# EAGLE design AutoProgramFTDI (EAGLE 9.2.0)
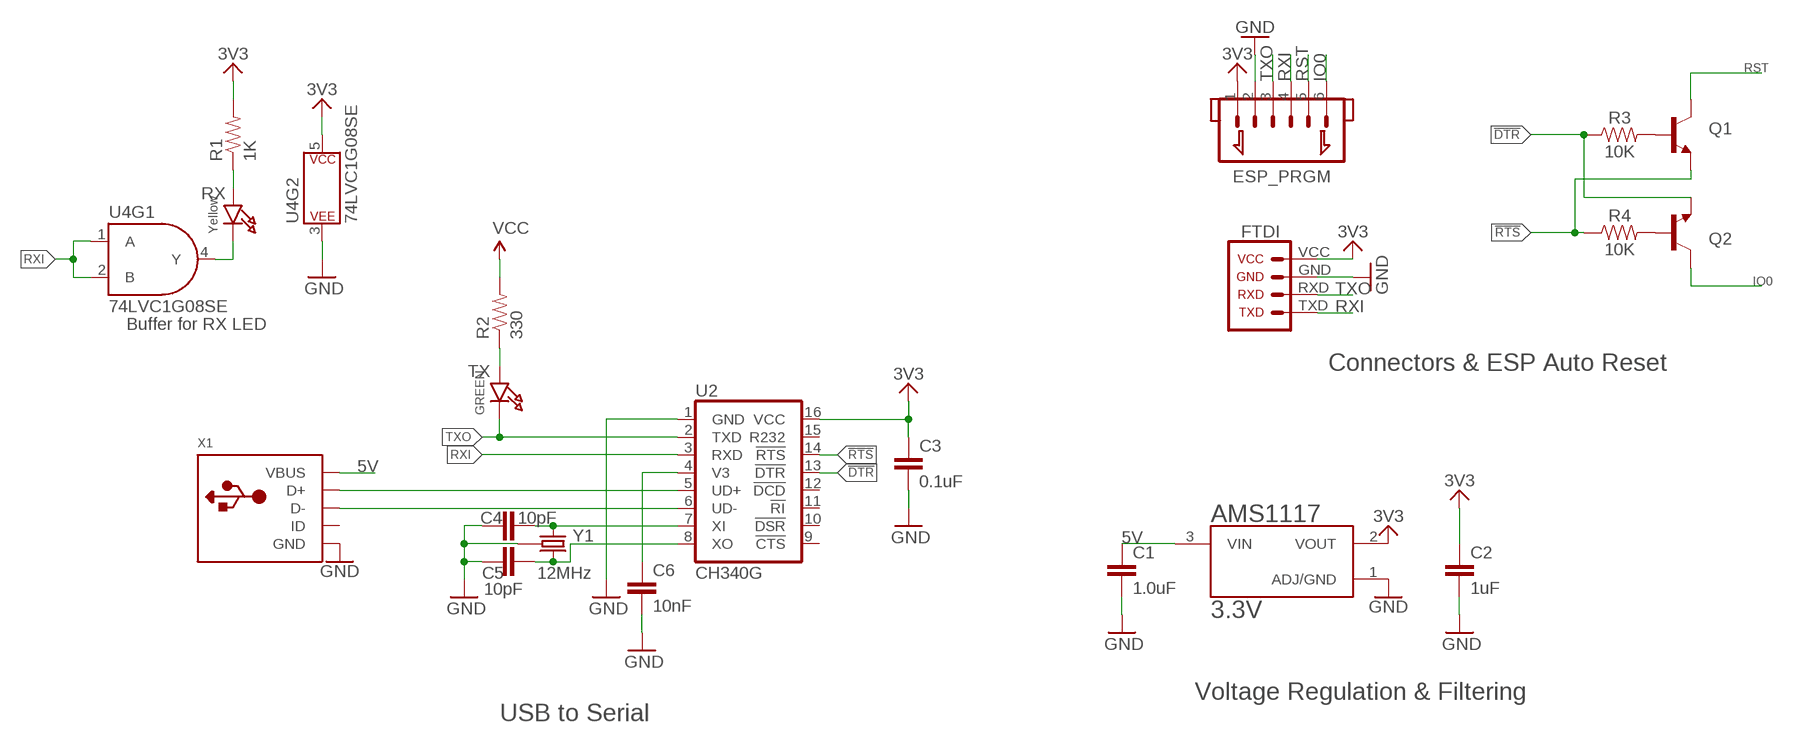
[diagram p0: schematic, sheet 1]

## Parts
AMS1117  3.3V  VREG_AMS1117  [SOT229P700X180-4N]
C1  1.0uF  1.0UF-16V-10%(0603)  [0603-CAP]
C2  1uF  1.0UF-16V-10%(0603)  [0603-CAP]
C3  0.1uF  0.1UF-25V(+80/-20%)(0603)  [0603-CAP]
C4  10pF  10PF-50V-5%(0603)  [0603-CAP]
C5  10pF  10PF-50V-5%(0603)  [0603-CAP]
C6  10nF  10NF/10000PF-50V-10%(0603)  [0603-CAP]
ESP_PRGM  JST_1.25_6P  [JST1.25_6P]
Q1  TRANSISTOR_NPNSOT23-3  [SPARKFUN_SOT23-3]
Q2  TRANSISTOR_NPNSOT23-3  [SPARKFUN_SOT23-3]
R1  1K  RESISTOR0603  [0603]
R2  330  RESISTOR0603  [0603]
R3  10K  RESISTOR0603  [0603]
R4  10K  RESISTOR0603  [0603]
RX  Yellow  LED0603  [MICROBUILDER_CHIPLED_0603]
TX  GREEN  LED0603  [MICROBUILDER_CHIPLED_0603]
U2  CH340G  FTDI_CH340GSMD  [SO016]
U4  74LVC1G08SE  GATE_7408  [SOT353]
U$6  FTDI  [1X06]
X1  USB_MICRO_20329_V2  [MICROUSB_4UCONN_20329_V2]
Y1  12MHz  CRYSTAL-GROUNDED3.2X2.5  [CRYSTAL-SMD-3.2X2.5]

## Nets
3.3V [power]: AMS1117.2(VOUT) C2.1 C3.1 ESP_PRGM.1 R1.2 U2.16(VCC) U4.5(P$V+) U$6.VCC ; supply symbol labelled SUPPLY_3.3V
5V: AMS1117.3(VIN) C1.1 X1.VBUS
!DTR: Q2.2(E) R3.1 U2.13(!DTR)
!RTS: Q1.2(E) R4.1 U2.14(!RTS)
GND [power]: AMS1117.1(ADJ/GND) C1.2 C2.2 C3.2 C4.1 C5.1 C6.2 ESP_PRGM.2 U2.1(GND) U4.3(P$V-) U$6.GND X1.BASE@1(GND) X1.BASE@2(GND) X1.GND X1.SPRT@1(GND) X1.SPRT@2(GND) X1.SPRT@3(GND) X1.SPRT@4(GND) Y1.2(GND) Y1.4(GND) ; supply symbol labelled SUPPLY_GND
IO0: ESP_PRGM.6 Q2.3(C)
N$1: R2.1 TX.A
N$2: R1.1 RX.A
N$3: C5.2 U2.8(XO) Y1.3
N$4: C4.2 U2.7(XI) Y1.1
N$5: RX.C U4.4(Y)
N$6: U2.6(UD-) X1.D-
N$7: U2.5(UD+) X1.D+
N$8: Q1.1(B) R3.2
N$9: Q2.1(B) R4.2
RST: ESP_PRGM.5 Q1.3(C)
RXI: ESP_PRGM.4 U2.3(RXD) U4.1(A) U4.2(B) U$6.TXD
TXO: ESP_PRGM.3 TX.C U2.2(TXD) U$6.RXD
V3: C6.1 U2.4(V3)
VCC: R2.2
Unconnected: U2.9(!CTS) U2.10(!DSR) U2.11(!RI) U2.12(!DCD) U2.15(R232) X1.ID

## Notes on the sheet
- Buffer for RX LED
- Connectors & ESP Auto Reset
- Voltage Regulation & Filtering
- USB to Serial

## Library data of the parts
AMS1117 = Scott-ICs:VREG_AMS1117: Sot223/Pkg 1-Amp 3.3-Volt Low Drop Out Voltage Regulatator; AVAILABILITY: Unavailable; DESCRIPTION: Sot223/Pkg 1-Amp 3.3-Volt Low Drop Out Voltage Regulatator; MF: Advanced Monolithic Systems; MP: AMS1117-3.3; PACKAGE: None; PRICE: None
C1 = SparkFun-Capacitors:1.0UF-16V-10%(0603): CAP-00868; PROD_ID: CAP-00868
C2 = SparkFun-Capacitors:1.0UF-16V-10%(0603): CAP-00868; PROD_ID: CAP-00868; VALUE: 1.0uF
C3 = SparkFun-Capacitors:0.1UF-25V(+80/-20%)(0603): CAP-00810 Ceramic Standard decoupling cap; PROD_ID: CAP-00810
C4 C5 = SparkFun-Capacitors:10PF-50V-5%(0603): CAP-11812; PROD_ID: CAP-11812
C6 = SparkFun-Capacitors:10NF/10000PF-50V-10%(0603): CAP-00867; PROD_ID: CAP-00867
ESP_PRGM = Scott-Connectors:JST_1.25_6P
Q1 Q2 = Scott-Electrical:TRANSISTOR_NPN: Transistor NPN BJT configuration in SOT23 package. MMBT2222 is the common NPN we use. Double check BCE configuration again layout.
R1-R4 = Scott-Electrical:RESISTOR: Generic Resistor Package
RX TX = Scott-Electrical:LED: LED 0603 - 0603 Surface Mount Package 2mA: Green LED - Low Power (3.9mcd, 2ma, 1.7Vf) - Digikey: 475-2709-2-ND Orange LED - Low Power (9.8mcd, 2ma, 1.8Vf) - Digikey: 475-1194-2-ND Red LED - Low Power (5mcd, 2ma, 1.8Vf) - Digikey: 475-1195-2-ND Yellow LED - Low Power (7mcd, 2ma, 1.8Vf) - Digikey: 475-1196-2-ND 5mA: Blue LED - Low Power (17mcd, 5ma, 2.9Vf) - Digikey: LNJ937W8CRACT-ND 0805 - 0805 Surface Mount Package 2mA: Red LED (8.8mcd, 2mA, 1.8Vf, Clear) - Low Power [Digikey: 475-2510-1-ND] Green LED (5mcd, 2mA, 1.8Vf, Clear) - Low Power [Digikey: 475-2730-1-ND] Yellow LED (11.3mcd, 2mA, 1.8Vf, Clear) - Low Power [Digikey: 475-2555-1-ND] 20mA: Red LED (104mcd, 20mA, Diffused) - LS R976 [Digikey: 475-1278-6-ND] Red LED (12mcd, 20mA, 2.0Vf, Clear) - APT2012EC [Digikey: 754-1128-1-ND] Green LED (15mcd, 20mA, 2.2Vf, Clear) - APT2012GC [Digikey: 754-1131-1-ND] Orange LED (160mcd, 20mA, 2.1Vf, Clear) - APT2012SECK [Digikey: 754-1130-1-ND] 1206 - 1206 Surface Mount Package Green LED (26mcd, 20mA, Diffused) - LG N971 [Digikey: 475-1407-6-ND] Red LED (15mcd, 20mA, Diffused) - LH N974 [Digikey: 475-1416-6-ND] Cree - Cree High-Power Surface Mount LEDs XPEBWT-L1-0000-00D50 - White 111lm 350mA 2.9Vf 6200K 110° XTEAWT-00-0000-00000LEE3 - White 114lm 350mA 2.85Vf 5000K 115° Everlight - Everlight 45-21 Series Surface Mount LEDs 45-21/QK2C-B2832AC2CB2/2T - Warm White 2000mcd 20mA 3.25Vf 3050K 120° 45-21/LK2C-B38452C4CB2/2T - Nuetral White 2000mcd 20mA 3.25Vf 4150K 120° 45-21/LK2C-B50634C6CB2/2T - Cold White 2200mcd 20mA 3.25Vf 5650K 120° PLCC2 Reverse Mount LS T77K-J1L2-1-0-2-R18-Z - Red 11.25mcd 2mA 1.8Vf 630nm 120° LO T77K-L1M2-24-Z - Orange 19.6mcd 2mA 1.8Vf 606nm 120° LY T77K-K2M1-26-Z - Yellow 15.7mcd 2mA 1.8Vf 587nm 120°
U2 = Scott-ICs:FTDI_CH340G: A simple USB 2.0 to Serial IC.; PROD_ID: IC-13498
U4 = Scott-ICs:GATE_74*08: Single AND gate IC GATE AND SNGL 2INPUT SOT353 SparkFun Products SparkFun LogicBlocks Kit <https://www.sparkfun.com/products/11006> (KIT-11006) SparkFun RedBot Mainboard <https://www.sparkfun.com/products/12097> (ROB-12097); PROD_ID: IC-10841
U$6 = Scott-Connectors:FTDI
X1 = Scott-Connectors:USB: USB Connectors USBMINIB - Surface Mount Female Mini-B USB Connector 4UConnector: 06564
Y1 = Scott-ICs:CRYSTAL-GROUNDED: Small, 3.2x2.5mm, SMD Crystal; PROD_ID: XTAL-13518

## Net classes
1 power: width 0.178 mm

## Board
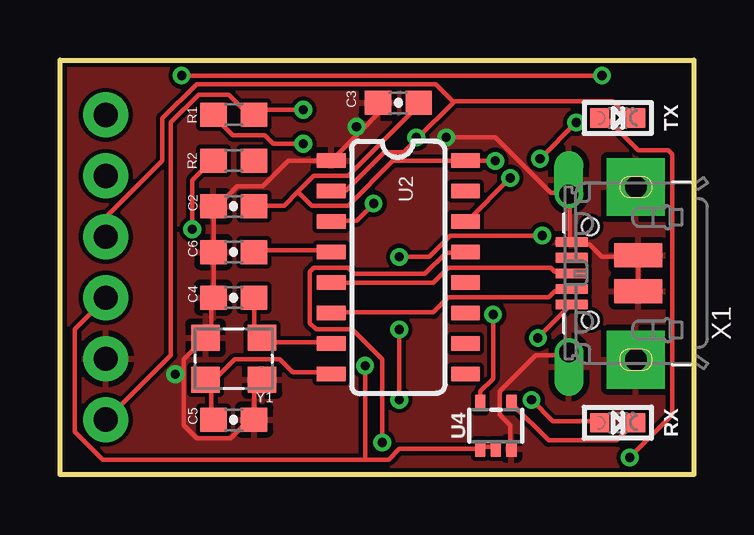
[diagram p1: board, top side]
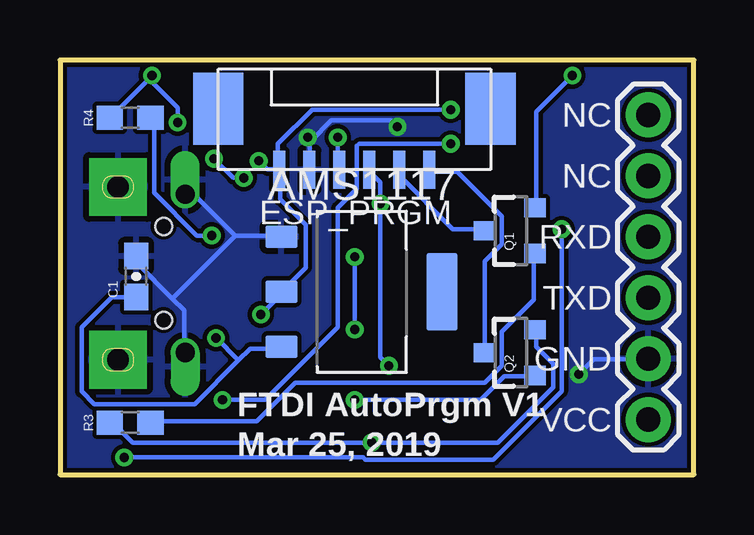
[diagram p2: board, bottom side, seen from below]

Size 26.42 x 17.27 mm. Coordinates in mm from the lower left corner, seen from the top.
Outline: 0,17.27 26.42,17.27 26.42,0 0,0 0,17.27
Copper layers (1*16): Top 0.035mm / dielectric 1.5mm / Bottom 0.035mm
Design rules "SparkFun-2-layer-TIGHT *": minimum track width 7mil, minimum drill 15mil, track to track 7mil, track to pad 7mil, pad to pad 7mil, via to via 7mil, smd to smd 7mil, copper to edge 7mil, drill to drill 7mil, minimum pad ring 7mil, minimum via ring 7mil, stop-mask expansion 4mil, vias tented up to drill 20mil, thermal gap 10mil

### Footprints (pad centres in the part's own frame; a part is rotated, then mirrored left to right if it is on the bottom)
SOT229P700X180-4N = smd 0.93 x 1.31: 1 -2.29,-3.345; 2 0,-3.345; 3 2.29,-3.345 | smd 3.24 x 1.31: 4 0,3.345
0603-CAP = smd 1.1 x 1: 1 -0.85,0; 2 0.85,0
JST1.25_6P = smd 0.5 x 1.6: 1 0,0; 2 1.25,0; 3 2.5,0; 4 3.75,0; 5 5,0; 6 6.25,0 | smd 2.1 x 3: 7 -2.55,2.55; 8 8.8,2.55
SPARKFUN_SOT23-3 = smd 0.8 x 0.9: 1 -0.95,-1; 2 0.95,-1; 3 0,1.1
0603 = smd 1.1 x 1: 1 -0.85,0; 2 0.85,0
MICROBUILDER_CHIPLED_0603 = smd 0.8 x 0.8: A 0,-0.75; C 0,0.75
SO016 = smd 0.6 x 1.2: 1 -4.445,-2.8; 2 -3.175,-2.8; 3 -1.905,-2.8; 4 -0.635,-2.8; 5 0.635,-2.8; 6 1.905,-2.8; 7 3.175,-2.8; 8 4.445,-2.8; 9 4.445,2.8; 10 3.175,2.8; 11 1.905,2.8; 12 0.635,2.8; 13 -0.635,2.8; 14 -1.905,2.8; 15 -3.175,2.8; 16 -4.445,2.8
SOT353 = smd 0.42 x 0.7: 1 -0.65,-0.95; 2 0,-0.95; 3 0.65,-0.95; 4 0.65,0.95; 5 -0.65,0.95
1X06 = drill 1.016 pad 1.88: GND 0,1.27; NC@1 0,-6.35; NC@2 0,-8.89; RXD 0,-3.81; TXD 0,-1.27; VCC 0,3.81
MICROUSB_4UCONN_20329_V2 = smd 1 x 2: BASE@1 -0.75,-2; BASE@2 0.75,-2 | smd 0.4 x 1.35: D+ 0,0.775; D- -0.65,0.775; GND 1.3,0.775; ID 0.65,0.775; VBUS -1.3,0.775 | drill 0.8 pad 1.143 offset: SPRT@1 -3.3,0.9; SPRT@2 3.3,0.9 | drill 0.9 pad 2.413 square: SPRT@3 -3.6,-1.9; SPRT@4 3.6,-1.9 | hole 0.7: -1.95,0; 1.95,0
CRYSTAL-SMD-3.2X2.5 = smd 1.2 x 1.1: 1 -1.175,-0.875; 2 1.175,-0.875; 3 1.175,0.875; 4 -1.175,0.875

### Placement (x,y rotation side)
AMS1117  13.84,7.62 270 bottom
C1  23.24,8.26 90 bottom
C2  7.24,11.18 180 top
C3  14.1,15.49 180 top
C4  7.24,7.37 0 top
C5  7.24,2.29 180 top
C6  7.24,9.27 180 top
ESP_PRGM  17.27,12.7 0 bottom
Q1  7.62,10.16 90 bottom
Q2  7.62,5.08 90 bottom
R1  7.24,14.99 0 top
R2  7.24,13.08 0 top
R3  23.5,2.16 0 bottom
R4  23.5,14.86 0 bottom
RX  23.24,2.16 270 top
TX  23.24,14.86 270 top
U2  14.1,8.64 270 top
U4  18.16,2.03 0 top
U$6  1.91,6.1 180 bottom
X1  22.1,8.38 90 top
Y1  7.24,4.83 180 top

### Tracks (layer width: path | path; a pad name or v marks a point on that pad's centre or on a via)
3.3V  (via drill 0.38)
  Top 0.178: v18.05,6.67 18.05,4 17.51,3.47 17.51,3.02 U4.5 | 9.91,11.78 10.58,12.45 12,12.45 15.02,15.47 C3.1 | 9.91,11.78 9.34,11.2 8.09,11.2 C2.1 | 9.91,11.78 10.49,11.2 12,11.2 13.87,13.07 16.89,13.07 U2.16 16.98,13.07 v18.14,13.07 | U$6.VCC 1.96,2.31 4.62,4.98 4.62,14.67 5.78,15.82 7.02,15.82 7.82,15.02 8,15.02 R1.2 8.09,15.02 8.27,15.2 v10.13,15.2
  Bottom 0.178: v18.05,6.67 17.16,7.56 AMS1117.2 17.16,7.64 16.18,8.62 16.18,10.4 17.25,11.47 17.25,12.62 ESP_PRGM.1 | v18.14,13.07 17.78,12.71 17.34,12.71 ESP_PRGM.1 | v10.13,15.2 15.91,15.2 17.34,13.78 17.34,12.8 ESP_PRGM.1
5V  (via drill 0.38)
  Top 0.178: v19.91,5.69 21.25,7.02 X1.VBUS
  Bottom 0.178: 18.98,4.76 18.49,5.25 17.25,5.25 AMS1117.3 | 18.98,4.76 20.8,2.93 24.98,2.93 25.51,3.47 25.51,6.13 24.27,7.38 23.29,7.38 C1.1 | 18.98,4.76 v19.91,5.69
!DTR  (via drill 0.38)
  Top 0.178: v13.42,1.33 13.42,4.8 12.18,6.04 10.67,6.04 10.4,6.31 10.4,8.45 10.58,8.62 12,8.62 12.27,8.36 15.2,8.36 16.09,9.25 16.89,9.25 U2.13
  Bottom 0.178: Q2.2 6.58,5.96 6.58,5.33 5.87,4.62 5.87,3.65 8.18,1.33 v13.42,1.33 23.38,1.33 24.27,2.22 R3.1
!RTS  (via drill 0.38)
  Top 0.178: v22.58,16.62 v5.07,16.62 | v18.76,12.36 16.98,10.58 U2.14 | v21.51,14.67 v20,13.16
  Bottom 0.178: v5.07,16.62 6.58,15.11 6.58,11.11 Q1.2 | R4.1 24.27,14.94 v22.58,16.62 22.67,16.45 21.51,15.29 v21.51,14.67 | v18.76,12.36 19.2,12.36 v20,13.16
GND  (via drill 0.38)
  Top 0.178: U4.3 18.76,1.16 18.76,2.04 18.31,2.49 18.31,3.47 19.82,4.98 21.07,4.98 21.16,5.07 X1.SPRT@1 | X1.BASE@1 24.09,7.64 24.09,9.07 X1.BASE@2 24,9.07 22.58,9.07 22.05,9.6 21.34,9.6 X1.GND 21.25,9.69 21.25,11.65 X1.SPRT@2 21.16,11.73 20.45,11.73 18.14,14.05 v16.09,14.05 | 12.54,14.31 11.38,13.16 U2.1 11.29,13.07 9.51,13.07 8.45,12 7.38,12 6.49,11.11 C2.2 6.4,11.11 6.4,9.34 C6.2 6.4,9.25 C4.1 6.31,7.29 6.31,5.96 6.13,5.78 Y1.2 6.04,5.69 5.16,4.8 5.16,4.18 | 12.54,14.31 13.25,15.02 13.25,15.47 C3.2 | 12.54,14.31 v12.36,14.49 | Y1.4 8.36,3.91 8.09,3.65 8.09,2.31 C5.1 8,2.22 7.82,2.22 7.11,1.51 5.69,1.51 5.16,2.04 5.16,4.18 | 5.16,4.18 v4.8,4.18
  Bottom 0.178: 21.74,7.33 21.25,6.84 21.25,5.16 X1.SPRT@1 | 21.74,7.33 23.2,8.8 23.2,9.07 C1.2 | 19.11,9.96 17.25,9.96 AMS1117.1 | 19.11,9.96 20.8,11.65 21.16,11.65 X1.SPRT@2 | 19.11,9.96 21.74,7.33 | 15.96,13.91 15.11,14.76 12.62,14.76 v12.36,14.49 | 15.96,13.91 16,13.87 16,12.71 ESP_PRGM.2 | v4.8,4.18 4.18,4.8 1.96,4.8 U$6.GND | 15.96,13.91 v16.09,14.05
  pour Top: 0,17.27 26.42,17.27 26.42,0 0,0
  pour Bottom: 0,17.27 26.42,17.27 26.42,0 0,0
IO0
  Bottom 0.178: Q2.3 8.71,5.16 8.71,8.89 8,9.6 8,10.76 9.87,12.62 10.94,12.62 ESP_PRGM.6
N$1  (via drill 0.38)
  Top 0.178: v23.74,0.71 25.51,2.49 25.51,13.34 25.34,13.51 24.09,13.51 22.76,14.85 22.49,14.85 TX.A | v5.51,10.22 5.51,12.27 6.31,13.07 R2.1
  Bottom 0.178: v23.74,0.71 13.78,0.71 13.69,0.62 8.36,0.62 5.51,3.47 v5.51,10.22
N$2  (via drill 0.38)
  Top 0.178: v19.65,3.11 20.54,2.22 22.4,2.22 RX.A | v10.13,13.78 8.89,13.78 8.53,14.13 7.2,14.13 6.4,14.94 R1.1
  Bottom 0.178: v19.65,3.11 17.87,3.11 14.85,6.13 14.85,11.11 14.05,11.91 14.05,13.69 13.96,13.78 v10.13,13.78
N$3
  Top 0.178: C5.2 6.31,2.31 6.31,3.73 6.13,3.91 Y1.3 6.31,3.82 7.29,4.8 9.16,4.8 9.69,4.27 11.29,4.27 U2.8
N$4
  Top 0.178: C4.2 8.09,7.29 8.09,6.04 8.36,5.78 Y1.1 8.45,5.69 8.62,5.51 11.29,5.51 U2.7
N$5
  Top 0.178: U4.4 18.85,2.93 20.36,1.42 23.2,1.42 23.91,2.13 RX.C
N$6
  Top 0.178: U2.6 11.38,6.76 15.56,6.76 16.18,7.38 20.36,7.38 20.62,7.64 21.25,7.64 X1.D-
N$7
  Top 0.178: U2.5 15.56,8 16.18,8.62 20.45,8.62 20.62,8.45 21.25,8.45 X1.D+
N$8
  Bottom 0.178: Q1.1 6.67,9.16 6.67,7.29 8,5.96 8,4.53 8.71,3.82 16.62,3.82 18.22,2.22 22.58,2.22 R3.2
N$9  (via drill 0.38)
  Top 0.178: v14.13,6.04 v14.13,3.11 | v14.13,9.07 15.38,9.07 16.27,9.96 v20.09,9.96
  Bottom 0.178: v14.13,3.11 8.89,3.11 7.91,4.09 6.67,4.09 Q2.1 | v14.13,9.07 v14.13,6.04 | v20.09,9.96 20.71,9.96 22.49,11.73 22.49,14.76 22.58,14.85 R4.2
RST
  Bottom 0.178: Q1.3 8.8,10.22 10.05,10.22 12.27,12.45 12.27,12.62 ESP_PRGM.5
RXI  (via drill 0.38)
  Top 0.178: v13.07,11.29 12.36,10.58 11.38,10.58 U2.3 | U4.2 18.14,1.16 17.51,1.16 U4.1 17.42,1.07 14.13,1.07 13.69,0.62 12.71,0.62 | 12.71,0.62 1.78,0.62 0.62,1.78 0.62,6.04 1.87,7.29 U$6.TXD | 12.71,0.62 v12.71,4.53
  Bottom 0.178: ESP_PRGM.4 13.51,12.62 13.07,12.18 v13.07,11.29 13.07,4.89 v12.71,4.53
TXO  (via drill 0.38)
  Top 0.178: 14.89,14 14.31,13.42 13.51,13.42 11.91,11.82 11.38,11.82 U2.2 | 14.89,14 16.4,15.51 | 16.4,15.51 16.45,15.56 23.02,15.56 23.65,14.94 23.91,14.94 TX.C | v14.85,14.05 14.89,14 | 16.4,15.51 15.65,16.27 5.69,16.27 4.27,14.85 4.27,13.07 1.96,10.76 1.96,9.96 U$6.RXD
  Bottom 0.178: v14.85,14.05 14.85,12.71 ESP_PRGM.3
V3
  Top 0.178: C6.1 8.09,9.34 11.29,9.34 U2.4

### Text on the board
bPlace: FTDI AutoPrgm V1 | Mar 25, 2019
Measures: All dimensions in inches